# Altium schematic sheet main.SchDoc
size A4
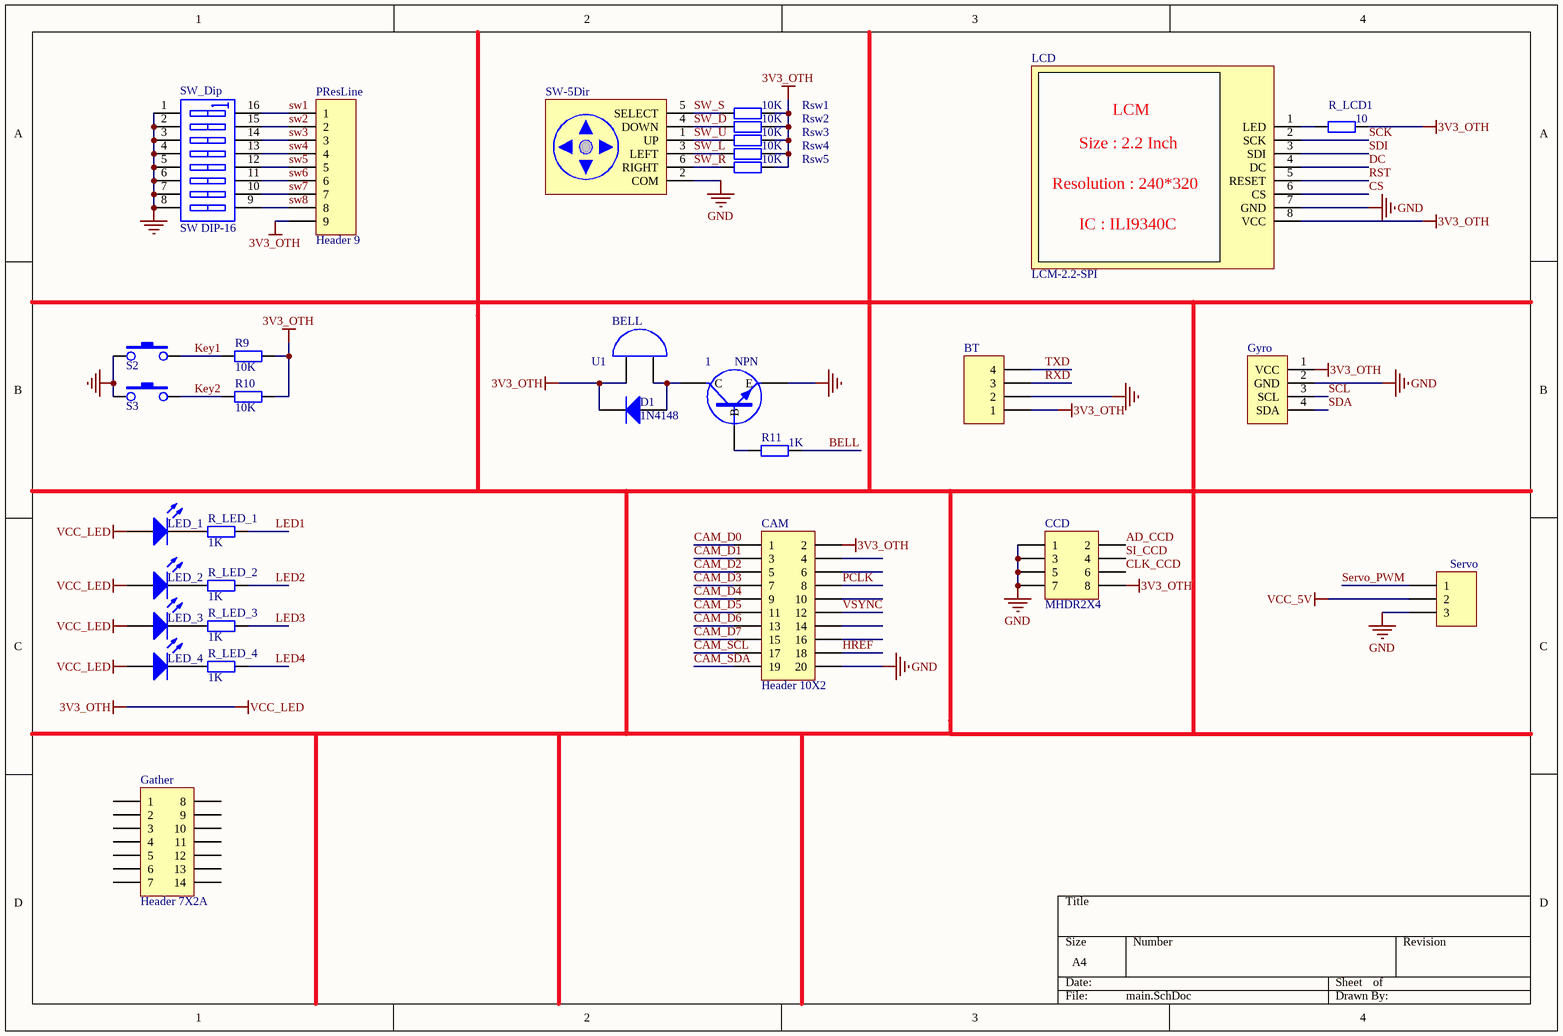
[diagram p0: main.SchDoc]

## Parts
1  NPN  [BEC_123_S]
BT  Header 4  [HDR1X4]  (value not drawn)
CAM  Header 10X2  [Camer]
CCD  MHDR2X4  [CCD]
D1  1N4148  [1N4148]
Gather  Header 7X2A  [HDR2X7_CEN]
Gyro  Gyro  [GYRO]  (value not drawn)
LCD  LCM-2.2-SPI  [LCD]
LED_1  LED  [0805-S]  (value not drawn)
LED_2  LED  [0805-S]  (value not drawn)
LED_3  LED  [0805-S]  (value not drawn)
LED_4  LED  [0805-S]  (value not drawn)
PResLine  Header 9  [HDR1X9]
R9  10K  [0805-S]
R10  10K  [0805-S]
R11  1K  [0805-S]
R_LCD1  10  [0805-S]
R_LED_1  1K  [0805-S]
R_LED_2  1K  [0805-S]
R_LED_3  1K  [0805-S]
R_LED_4  1K  [0805-S]
Rsw1  10K  [0805-S]
Rsw2  10K  [0805-S]
Rsw3  10K  [0805-S]
Rsw4  10K  [0805-S]
Rsw5  10K  [0805-S]
S2  SW-PB  [key-press]  (value not drawn)
S3  SW-PB  [key-press]  (value not drawn)
Servo  Ser_head  [HDR1X3]  (value not drawn)
SW-5Dir  SW-5dir  [SW-5dir]  (value not drawn)
SW_Dip  SW DIP-16  [DIP16]
U1  BELL  [BEEP]

## Nets
3V3_OTH: BT.1 CAM.2 CCD.8 D1.2(K) Gyro.1(VCC) LCD.8(VCC) LED_1.1(A) LED_2.1(A) LED_3.1(A) LED_4.1(A) PResLine.9 R9.1 R10.1 R_LCD1.1 Rsw1.2 Rsw2.2 Rsw3.2 Rsw4.2 Rsw5.2 U1.1(A)  [also labelled VCC_LED]
GND: 1.2(E) BT.2 CAM.20 CCD.1 CCD.3 CCD.5 CCD.7 Gyro.2(GND) LCD.7(GND) S2.1 S3.1 Servo.3 SW-5Dir.2(COM) SW_Dip.1(A1) SW_Dip.2(A2) SW_Dip.3(A3) SW_Dip.4(A4) SW_Dip.5(A5) SW_Dip.6(A6) SW_Dip.7(A7) SW_Dip.8(A8)
VCC_5V: Servo.2
AD_CCD: CCD.2
BELL: R11.2
CAM_D0: CAM.1
CAM_D1: CAM.3
CAM_D2: CAM.5
CAM_D3: CAM.7
CAM_D4: CAM.9
CAM_D5: CAM.11
CAM_D6: CAM.13
CAM_D7: CAM.15
CAM_SCL: CAM.17
CAM_SDA: CAM.19
CLK_CCD: CCD.6
CS: LCD.6(CS)
DC: LCD.4(DC)
HREF: CAM.18
Key1: R9.2 S2.2
Key2: R10.2 S3.2
LED1: R_LED_1.1
LED2: R_LED_2.1
LED3: R_LED_3.1
LED4: R_LED_4.1
PCLK: CAM.8
RST: LCD.5(RESET)
RXD: BT.3
SCK: LCD.2(SCK)
SCL: Gyro.3(SCL)
SDA: Gyro.4(SDA)
SDI: LCD.3(SDI)
Servo_PWM: Servo.1
SI_CCD: CCD.4
sw1: PResLine.1 SW_Dip.16(B1)
sw2: PResLine.2 SW_Dip.15(B2)
sw3: PResLine.3 SW_Dip.14(B3)
sw4: PResLine.4 SW_Dip.13(B4)
sw5: PResLine.5 SW_Dip.12(B5)
sw6: PResLine.6 SW_Dip.11(B6)
sw7: PResLine.7 SW_Dip.10(B7)
sw8: PResLine.8 SW_Dip.9(B8)
SW_D: Rsw2.1 SW-5Dir.4(DOWN)
SW_L: Rsw4.1 SW-5Dir.3(LEFT)
SW_R: Rsw5.1 SW-5Dir.6(RIGHT)
SW_S: Rsw1.1 SW-5Dir.5(SELECT)
SW_U: Rsw3.1 SW-5Dir.1(UP)
TXD: BT.4
VSYNC: CAM.12
Net1_1: 1.1(B) R11.1
Net1_3: 1.3(C) D1.1(A) U1.2(B)
NetLCD_1: LCD.1(LED) R_LCD1.2
NetLED_1_2: LED_1.2(K) R_LED_1.2
NetLED_2_2: LED_2.2(K) R_LED_2.2
NetLED_3_2: LED_3.2(K) R_LED_3.2
NetLED_4_2: LED_4.2(K) R_LED_4.2

Not connected (* = marked no-connect by the designer): CAM 4 6 10 14 16; Gather 1 2 3 4 5 6 7 8 9 10 11 12 13 14

## Notes on the sheet
- (in symbol LCM-2.2-SPI) LCM; Size : 2.2 Inch; Resolution : 240*320; IC : ILI9340C

## Library data of the parts
BT = Header 4: Header, 4-Pin; LatestRevisionDate: 17-Jul-2002; LatestRevisionNote: Re-released for DXP Platform.; Publisher: Altium Limited
CAM = Header 10X2: Header, 10-Pin, Dual row; LatestRevisionDate: 17-Jul-2002; LatestRevisionNote: Re-released for DXP Platform.; Publisher: Altium Limited
CCD = MHDR2X4: Header, 4-Pin, Dual row; LatestRevisionDate: 17-Jul-2002; LatestRevisionNote: Re-released for DXP Platform.; Publisher: Altium Limited
D1 = Diode: Published: 8-Jun-2000; LatestRevisionDate: 17-Jul-2002; LatestRevisionNote: Re-released for DXP Platform.; PackageDocument: Sep-1996; Publisher: Altium Limited; Code_JEDEC: DO-214-AB
Gather = Header 7X2A: Header, 7-Pin, Dual row; LatestRevisionDate: 17-Jul-2002; LatestRevisionNote: Re-released for DXP Platform.; Publisher: Altium Limited
LCD = LCM-2.2-SPI: LCM 2.2inch SPI; LatestRevisionDate: 17-Jul-2002; LatestRevisionNote: Re-released for DXP Platform.; Publisher: Altium Limited
LED_1-LED_4 = LED0: Typical INFRARED GaAs LED; Published: 8-Jun-2000; LatestRevisionDate: 08-Jul-2005; LatestRevisionNote: Mech Layer 1 removed.; PackageReference: LED-0; Publisher: Altium Limited
PResLine = Header 9: Header, 9-Pin; LatestRevisionDate: 17-Jul-2002; LatestRevisionNote: Re-released for DXP Platform.; Publisher: Altium Limited
R9 R10 R_LCD1 = Res2: Resistor; Value: 3.32K; Published: 8-Jun-2000; LatestRevisionDate: 17-Jul-2002; LatestRevisionNote: Re-released for DXP Platform.; PackageReference: AXIAL-0.4; Publisher: Altium Limited; PackageDescription: Axial Device, Thru-Hole; 2 Leads; 0.4 in Pin Spacing
R11 R_LED_1-R_LED_4 = Res2: Resistor; Published: 8-Jun-2000; LatestRevisionDate: 17-Jul-2002; LatestRevisionNote: Re-released for DXP Platform.; PackageReference: AXIAL-0.4; Publisher: Altium Limited; Value: 1K
Rsw1-Rsw5 = Res2: Resistor; Value: 1K; Published: 8-Jun-2000; LatestRevisionDate: 17-Jul-2002; LatestRevisionNote: Re-released for DXP Platform.; PackageReference: AXIAL-0.4; Publisher: Altium Limited
Servo = Header 3: Header, 3-Pin; LatestRevisionDate: 17-Jul-2002; LatestRevisionNote: Re-released for DXP Platform.; Publisher: Altium Limited
SW-5Dir = SW-5dir: 2pin_GND; LatestRevisionDate: 17-Jul-2002; LatestRevisionNote: Re-released for DXP Platform.; Publisher: Altium Limited
SW_Dip = SW DIP-8: DIP Switch, 8 Position, SPST; Published: 24-Mar-1999; LatestRevisionDate: 17-Jul-2002; LatestRevisionNote: Re-released for DXP Platform.; PackageReference: DIP_SW_8WAY_SMD; Publisher: Altium Limited